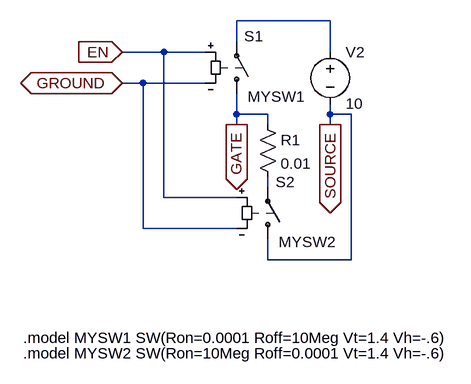
[diagram p0: schematic gatedriver.asc]
gatedriver.asc, the LTspice schematic file:
Version 4
SHEET 1 1276 680
WIRE 336 144 192 144
WIRE 192 176 192 144
WIRE 80 192 16 192
WIRE 144 192 80 192
WIRE 336 192 336 144
WIRE 48 240 16 240
WIRE 144 240 48 240
WIRE 192 288 192 256
WIRE 240 288 192 288
WIRE 336 288 336 272
WIRE 368 288 336 288
WIRE 192 304 192 288
WIRE 240 304 240 288
WIRE 336 304 336 288
WIRE 240 400 240 384
WIRE 80 416 80 192
WIRE 192 416 80 416
WIRE 48 464 48 240
WIRE 192 464 48 464
WIRE 240 512 240 480
WIRE 368 512 368 288
WIRE 368 512 240 512
FLAG 16 192 EN
IOPIN 16 192 In
FLAG 192 304 GATE
IOPIN 192 304 Out
FLAG 336 304 SOURCE
IOPIN 336 304 Out
FLAG 16 240 GROUND
IOPIN 16 240 BiDir
SYMBOL sw 192 272 M180
WINDOW 0 12 104 Left 2
WINDOW 3 17 11 Left 2
SYMATTR InstName S1
SYMATTR Value MYSW1
SYMBOL voltage 336 176 R0
WINDOW 123 0 0 Left 0
WINDOW 39 24 124 Left 2
SYMATTR InstName V2
SYMATTR Value 10
SYMBOL sw 240 496 M180
WINDOW 0 12 104 Left 2
WINDOW 3 17 11 Left 2
SYMATTR InstName S2
SYMATTR Value MYSW2
SYMBOL res 224 288 R0
SYMATTR InstName R1
SYMATTR Value 0.01
SYMATTR SpiceLine tol=1
TEXT -136 632 Left 2 !.model MYSW1 SW(Ron=0.0001 Roff=10Meg Vt=1.4 Vh=-.6)
TEXT -136 656 Left 2 !.model MYSW2 SW(Ron=10Meg Roff=0.0001 Vt=1.4 Vh=-.6)

The netlist it stands for:
* gatedriver.asc
S1 GATE N001 EN GROUND MYSW1
V2 N001 SOURCE 10
S2 SOURCE N002 EN GROUND MYSW2
R1 GATE N002 0.01 tol=1
.model MYSW1 SW(Ron=0.0001 Roff=10Meg Vt=1.4 Vh=-.6)
.model MYSW2 SW(Ron=10Meg Roff=0.0001 Vt=1.4 Vh=-.6)
.backanno
.end